# EAGLE board PEGMARev0 (EAGLE 6.6.0), part 1 of 3
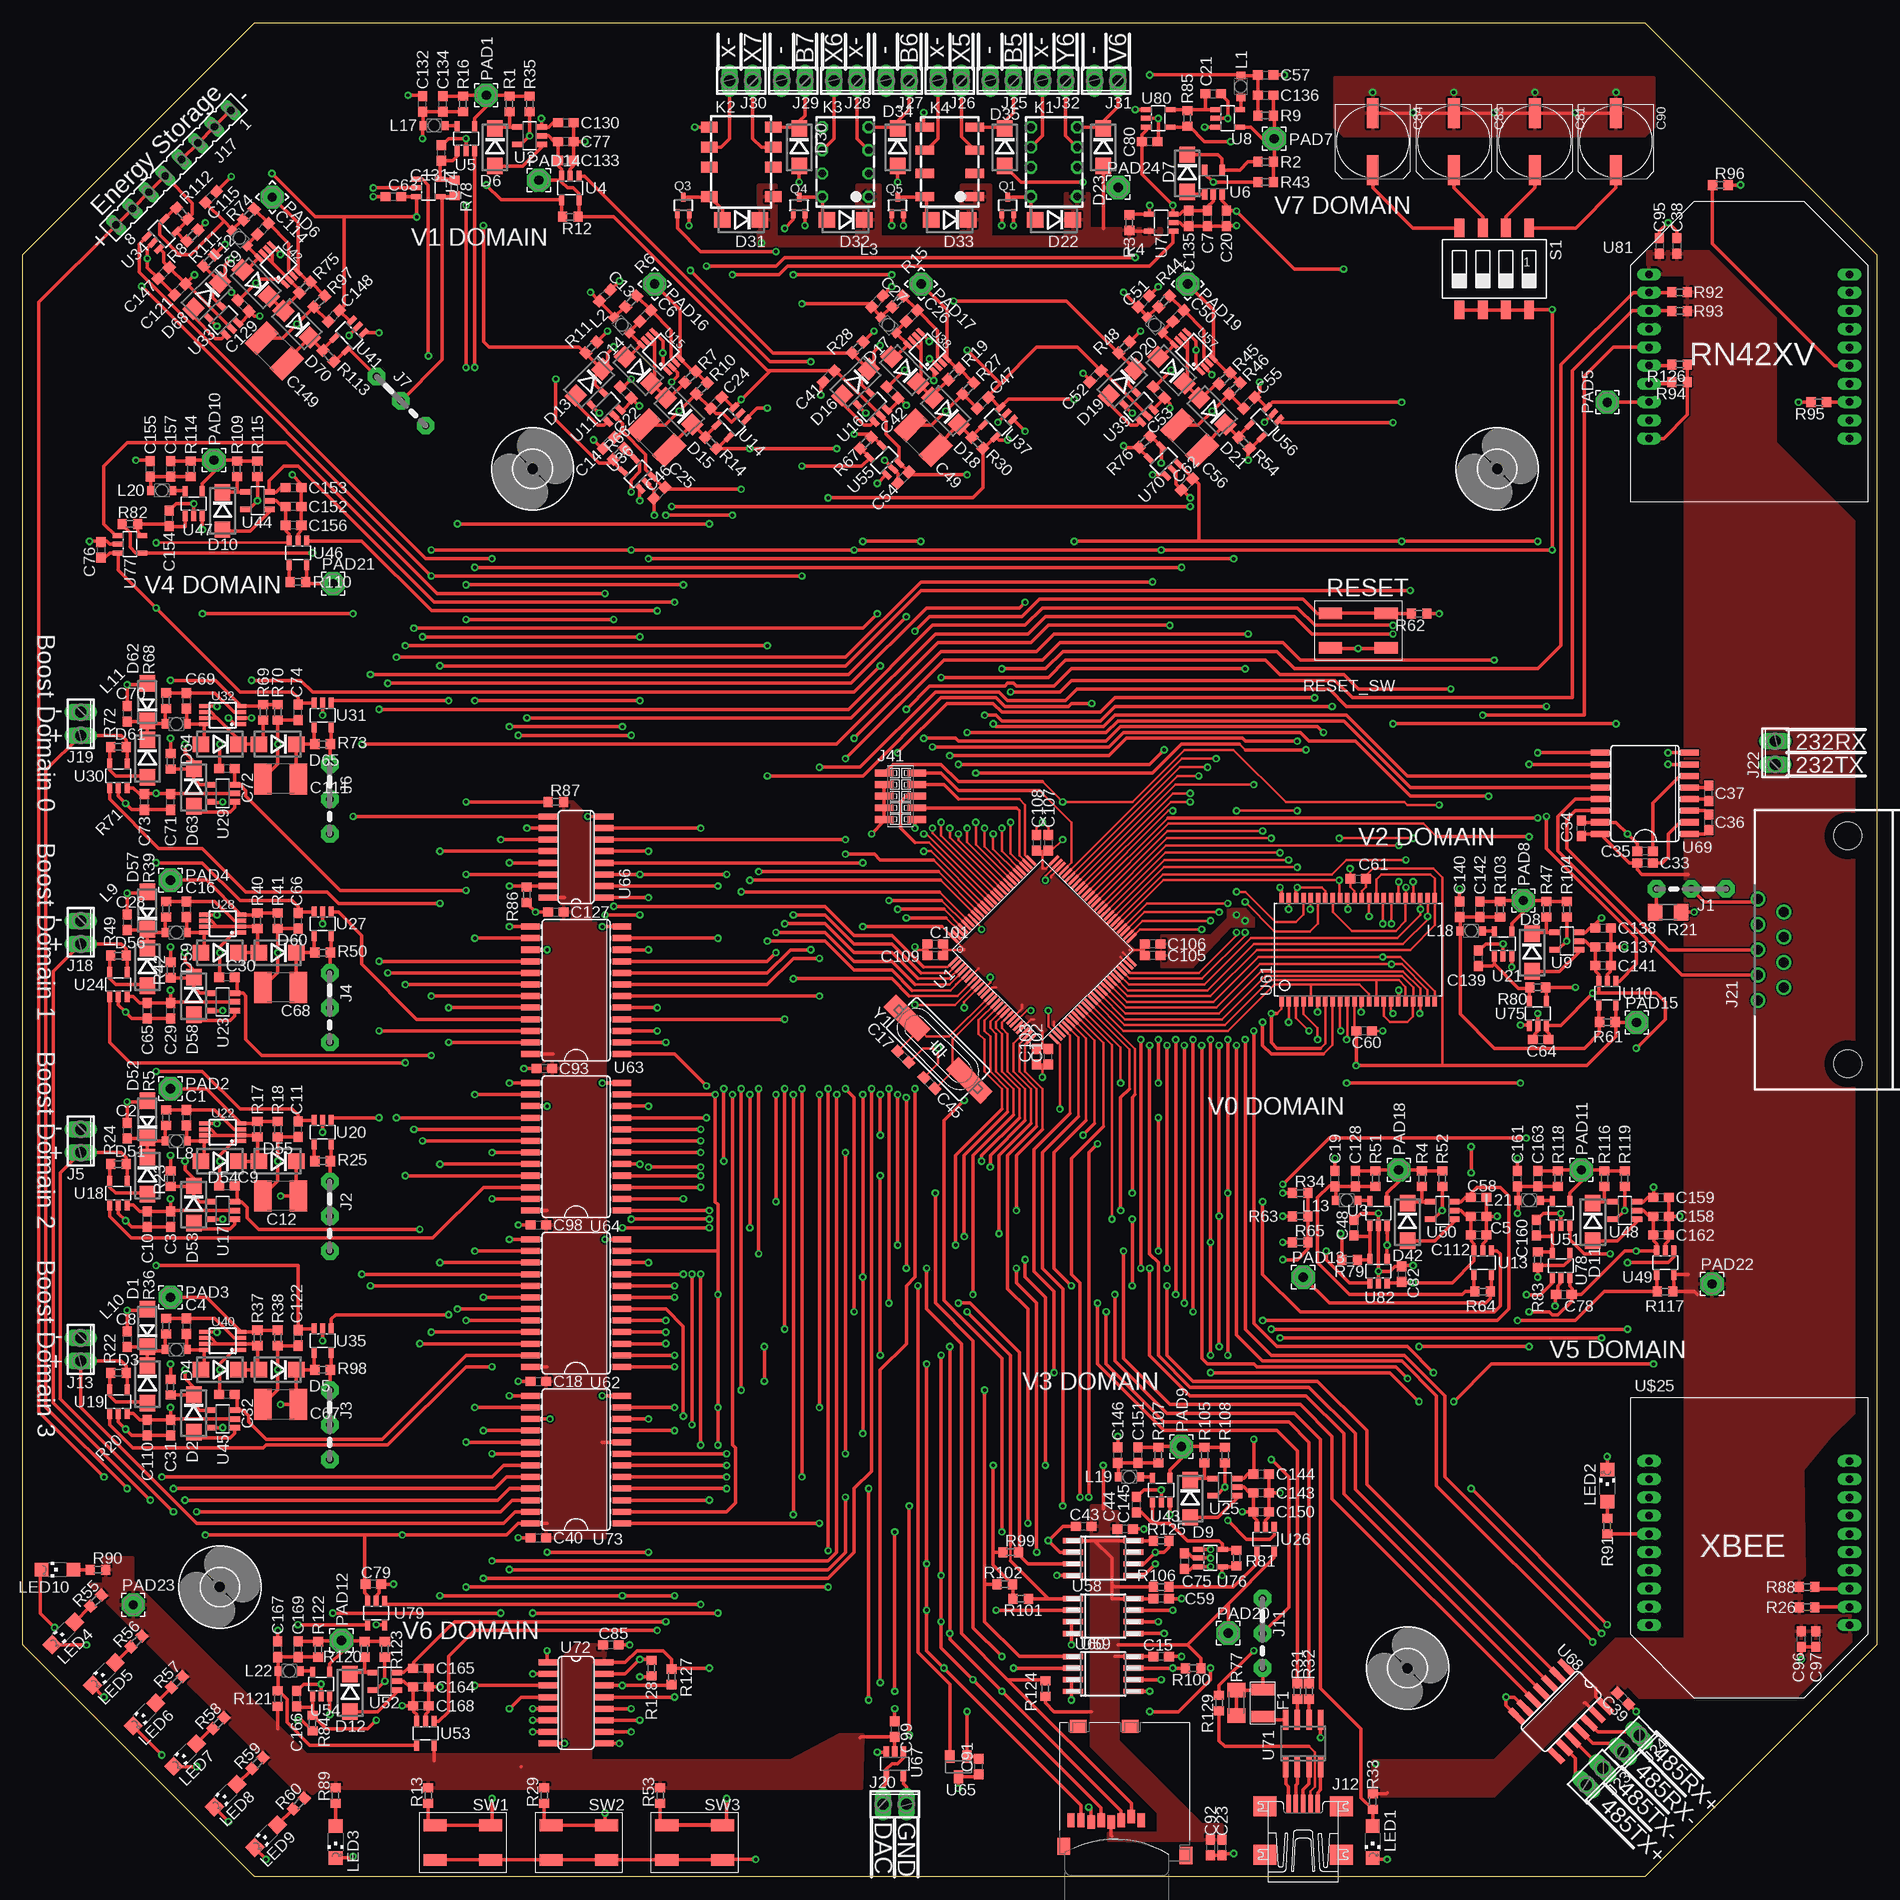
[diagram p5: board, top side]
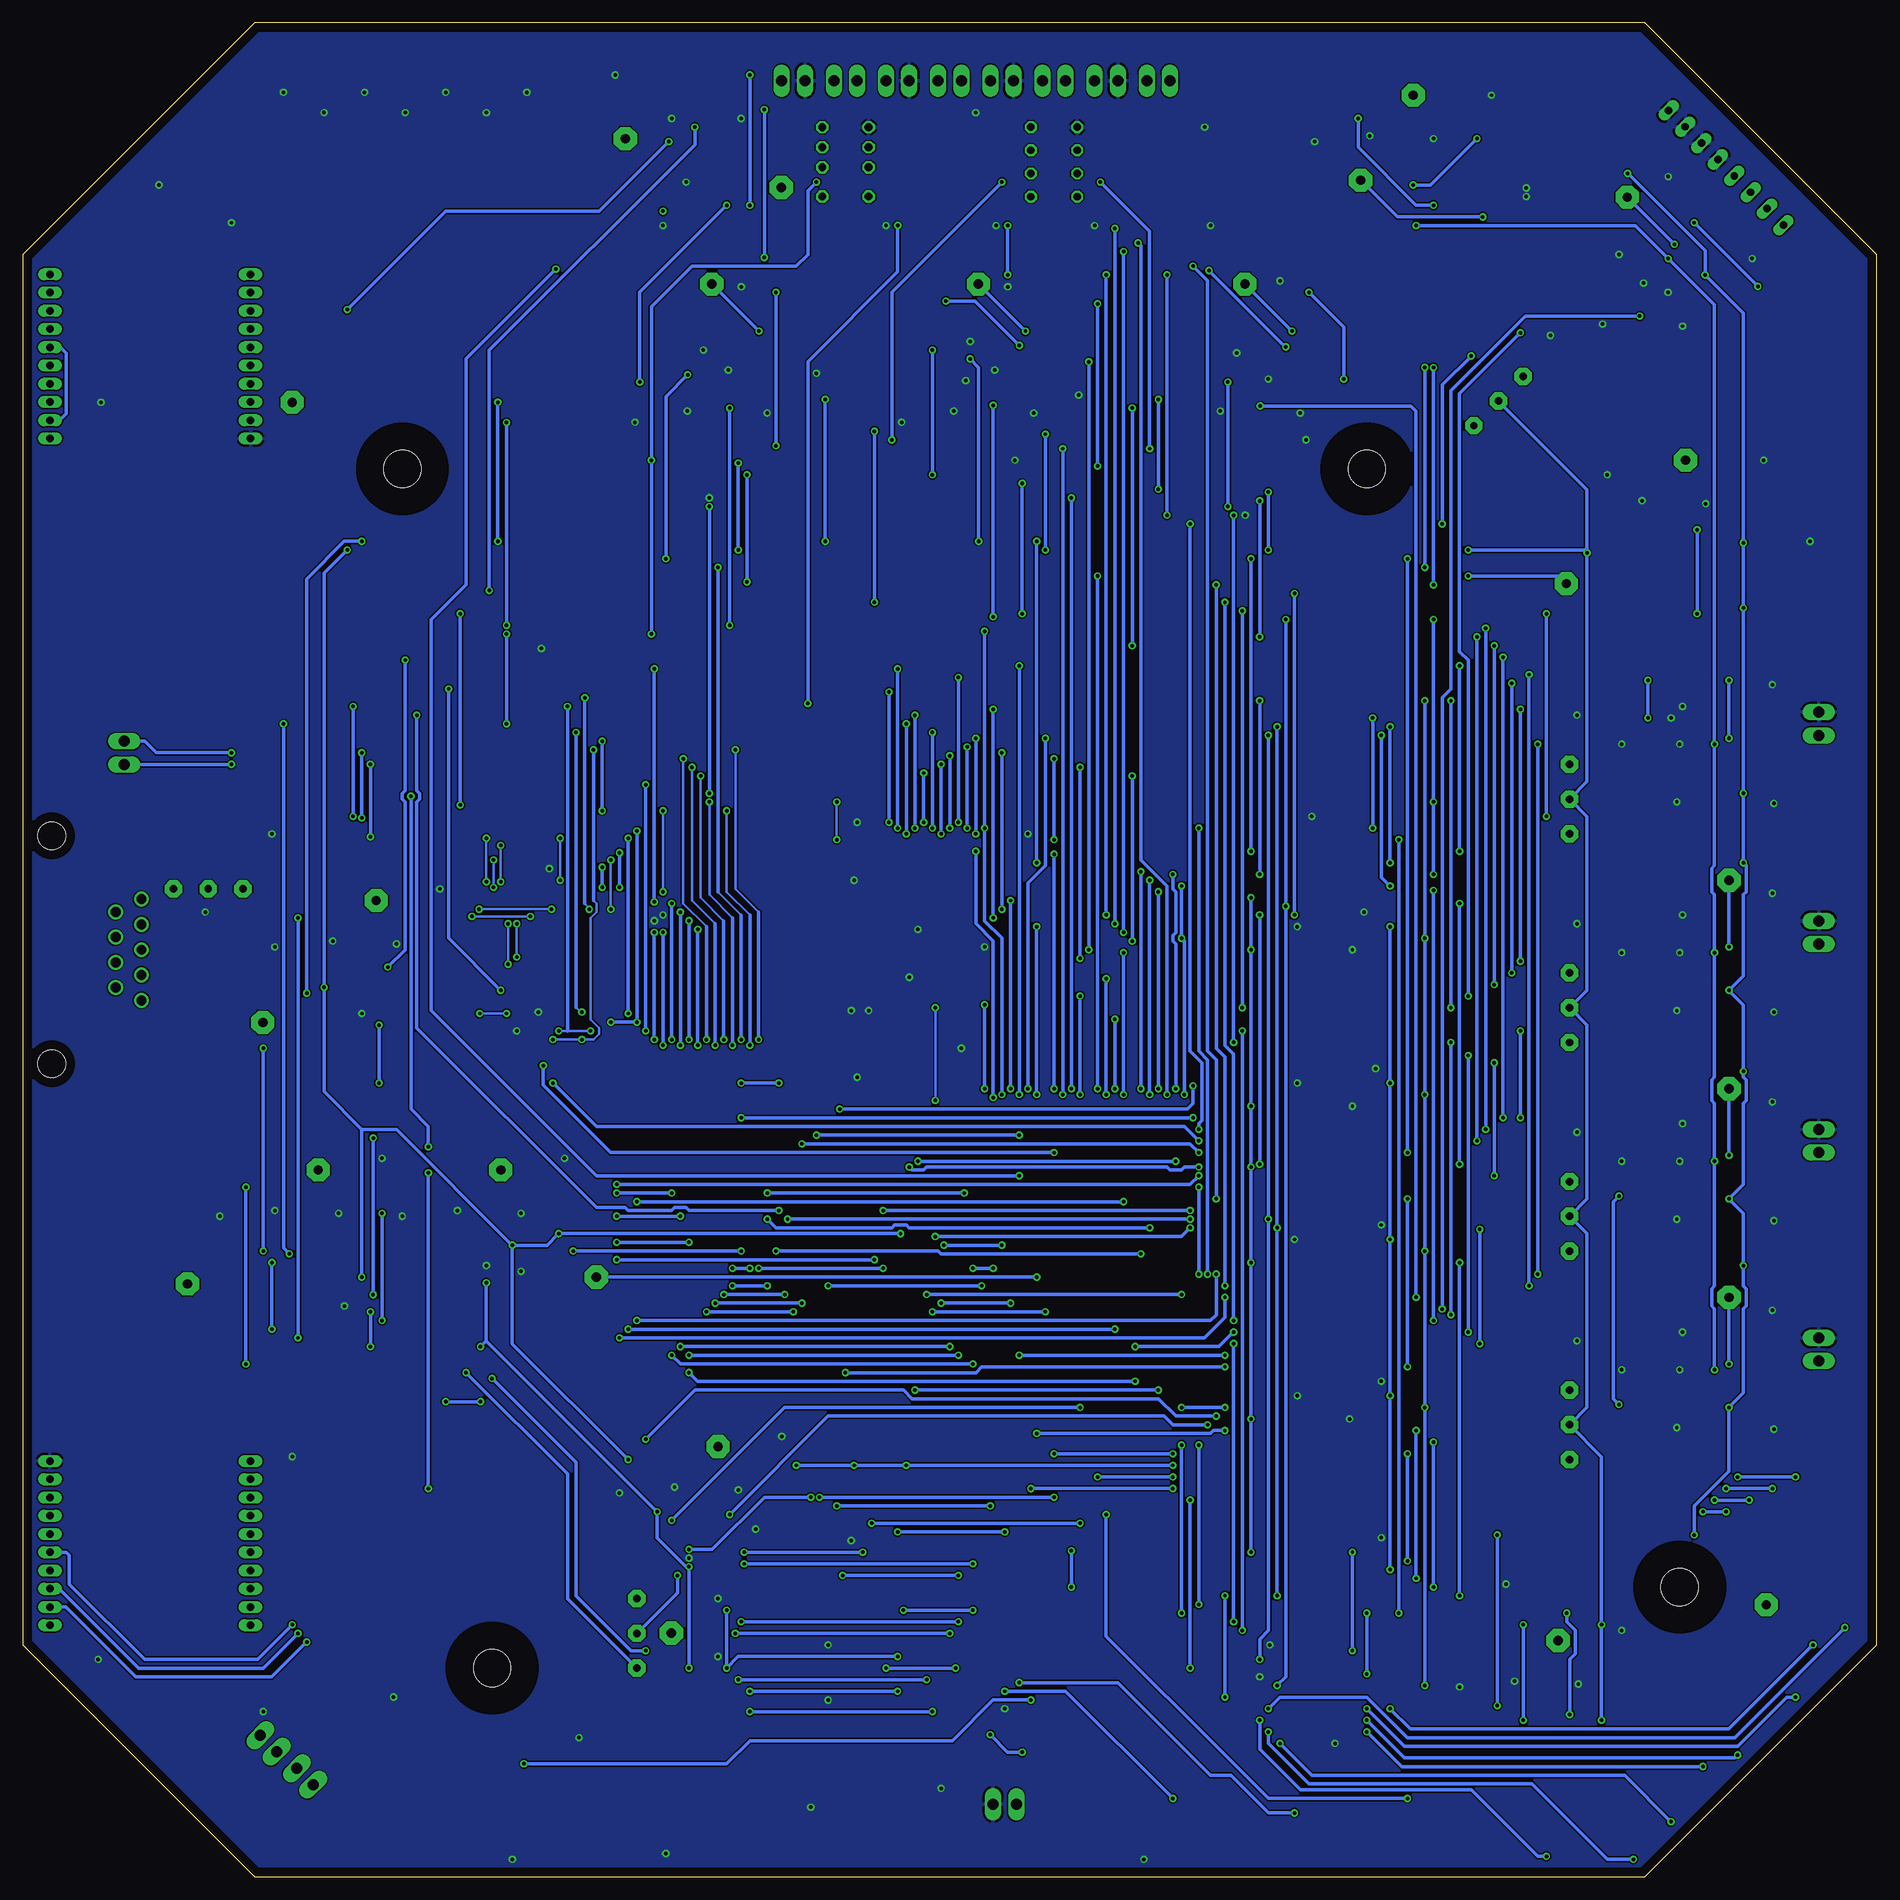
[diagram p6: board, bottom side, seen from below]

Size 203.2 x 203.2 mm. Coordinates in mm from the lower left corner, seen from the top.
Outline: 25.4,0 0,25.4 0,177.8 25.4,203.2 177.8,203.2 203.2,177.8 203.2,25.4 177.8,0 25.4,0
Copper layers (1*16): Top 0.035mm / dielectric 1.5mm / Bottom 0.035mm
Design rules "default": minimum track width 10mil, minimum drill 15mil, track to track 6mil, track to pad 6mil, pad to pad 6mil, via to via 6mil, smd to smd 6mil, copper to edge 40mil, drill to drill 8mil, minimum pad ring 10mil, minimum via ring 8mil, stop-mask expansion 4mil, vias tented up to drill 0mil, thermal gap 10mil

## Footprints (pad centres in the part's own frame; a part is rotated, then mirrored left to right if it is on the bottom)
C0603 = smd 1.1 x 1: 1 -0.85,0; 2 0.85,0
C1812 = smd 1.9 x 3.4: 1 -1.95,0; 2 1.95,0
UD-8X10_NICHICON = smd 3.3 x 1.3: + 3.125,0; - -3.125,0
DO214AC = smd 1.8 x 1.7: A 2.05,0; C -2.05,0
DO214BA = smd 1.8 x 1.7: A 2.05,0; C -2.05,0
FUSE(1210) = smd 1.27 x 2.54: P$1 -1.483,0.03; P$2 1.517,0.03
04C = drill 0.813 pad 1.905 octagon: 1 -1.905,0; 2 1.905,0; 3 5.715,0
2POL254 = drill 1.2 long: 1 -1.27,0; 2 1.27,0
UX60A-MB-5ST = smd 2 x 0.5: 1 2.25,1.6; 2 2.25,0.8; 3 2.25,0; 4 2.25,-0.8; 5 2.25,-1.6 | smd 2.2 x 2.5: M1 -3.3,-4.2; M2 -3.3,4.2; M3 2,4.2; M4 2,-4.2
FE08 = drill 0.813 long: 1 -8.89,0; 2 -6.35,0; 3 -3.81,0; 4 -1.27,0; 5 1.27,0; 6 3.81,0; 7 6.35,0; 8 8.89,0
H2M09RA = drill 1.092: 1 -5.537,7.925; 2 -2.769,7.925; 3 0,7.925; 4 2.769,7.925; 5 5.537,7.925; 6 -4.153,5.08; 7 -1.384,5.08; 8 1.384,5.08; 9 4.153,5.08 | hole 3.048: -12.497,-1.905; 12.497,-1.905
1296-10 = smd 0.76 x 2.05: 1 -2.54,-1.78; 2 -2.54,1.78; 3 -1.27,-1.78; 4 -1.27,1.78; 5 0,-1.78; 6 0,1.78; 7 1.27,-1.78; 8 1.27,1.78; 9 2.54,-1.78; 10 2.54,1.78
G6KU-2P-Y = drill 0.85 octagon: 1 -3.8,-2.54; 2 -0.6,-2.54; 3 1.6,-2.54; 4 3.8,-2.54; 5 3.8,2.54; 6 1.6,2.54; 7 -0.6,2.54; 8 -3.8,2.54
G6KU-2F-Y = smd 1.2 x 1.8: 1 -3.8,-3.5; 2 -0.6,-3.5; 3 1.6,-3.5; 4 3.8,-3.5; 5 3.8,3.5; 6 1.6,3.5; 7 -0.6,3.5; 8 -3.8,3.5
G6K-2P = drill 0.8 octagon: 1 -2.54,-2.54; 2 0,-2.54; 3 2.54,-2.54; 4 5.08,-2.54; 5 5.08,2.54; 6 2.54,2.54; 7 0,2.54; 8 -2.54,2.54
G6K-2G = smd 1 x 2: 1 -3.81,-2.75; 2 -1.27,-2.75; 3 1.27,-2.75; 4 3.81,-2.75; 5 3.81,2.75; 6 1.27,2.75; 7 -1.27,2.75; 8 -3.81,2.75
L1008/2520METRIC = smd 0.8 x 1: 1 -1.2,0; 2 1.2,0
CHIPLED_1206 = smd 1.5 x 1.5: A 0,-1.75; C 0,1.75
2,54/1,0 = drill 1.016 pad 2.54 octagon: 1 0,0
SOT323 = smd 0.5 x 1: 1 0,0.9; 2 -0.65,-0.9; 3 0.65,-0.9
R0603 = smd 1 x 1.1: 1 -0.85,0; 2 0.85,0
R1206 = smd 1.6 x 1.803: 1 -1.422,0; 2 1.422,0
M1206 = smd 1.6 x 2: 1 -1.4,0; 2 1.4,0
SWITCH(B3SN) = smd 2.54 x 1.27: 1 -3.071,-1.97; 2 3.029,-1.97; 3 3.029,1.83; 4 -3.071,1.83
SMS-004 = smd 1.092 x 2.007: 1 -3.81,-4.496; 2 -1.27,-4.496; 3 1.27,-4.496; 4 3.81,-4.496; 5 3.81,4.496; 6 1.27,4.496; 7 -1.27,4.496; 8 -3.81,4.496
PZ100 = smd 1.4 x 0.3: 1 -7.8,6; 2 -7.8,5.5; 3 -7.8,5; 4 -7.8,4.5; 5 -7.8,4; 6 -7.8,3.5; 7 -7.8,3; 8 -7.8,2.5; 9 -7.8,2; 10 -7.8,1.5; 11 -7.8,1; 12 -7.8,0.5; 13 -7.8,0; 14 -7.8,-0.5; 15 -7.8,-1; 16 -7.8,-1.5; 17 -7.8,-2; 18 -7.8,-2.5; 19 -7.8,-3; 20 -7.8,-3.5; 21 -7.8,-4; 22 -7.8,-4.5; 23 -7.8,-5; 24 -7.8,-5.5; 25 -7.8,-6; 51 7.8,-6; 52 7.8,-5.5; 53 7.8,-5; 54 7.8,-4.5; 55 7.8,-4; 56 7.8,-3.5; 57 7.8,-3; 58 7.8,-2.5; 59 7.8,-2; 60 7.8,-1.5; 61 7.8,-1; 62 7.8,-0.5; 63 7.8,0; 64 7.8,0.5; 65 7.8,1; 66 7.8,1.5; 67 7.8,2; 68 7.8,2.5; 69 7.8,3; 70 7.8,3.5; 71 7.8,4; 72 7.8,4.5; 73 7.8,5; 74 7.8,5.5; 75 7.8,6 | smd 0.3 x 1.4: 26 -6,-7.8; 27 -5.5,-7.8; 28 -5,-7.8; 29 -4.5,-7.8; 30 -4,-7.8; 31 -3.5,-7.8; 32 -3,-7.8; 33 -2.5,-7.8; 34 -2,-7.8; 35 -1.5,-7.8; 36 -1,-7.8; 37 -0.5,-7.8; 38 0,-7.8; 39 0.5,-7.8; 40 1,-7.8; 41 1.5,-7.8; 42 2,-7.8; 43 2.5,-7.8; 44 3,-7.8; 45 3.5,-7.8; 46 4,-7.8; 47 4.5,-7.8; 48 5,-7.8; 49 5.5,-7.8; 50 6,-7.8; 76 6,7.8; 77 5.5,7.8; 78 5,7.8; 79 4.5,7.8; 80 4,7.8; 81 3.5,7.8; 82 3,7.8; 83 2.5,7.8; 84 2,7.8; 85 1.5,7.8; 86 1,7.8; 87 0.5,7.8; 88 0,7.8; 89 -0.5,7.8; 90 -1,7.8; 91 -1.5,7.8; 92 -2,7.8; 93 -2.5,7.8; 94 -3,7.8; 95 -3.5,7.8; 96 -4,7.8; 97 -4.5,7.8; 98 -5,7.8; 99 -5.5,7.8; 100 -6,7.8
SOT23-5 = smd 0.6 x 1.2: 1 -0.95,-1.306; 2 0,-1.306; 3 0.95,-1.306; 4 0.95,1.306; 5 -0.95,1.306
SOT23-5' = smd 0.55 x 1.2: 1 -0.95,-1.3; 2 0,-1.3; 3 0.95,-1.3; 4 0.95,1.3; 5 -0.95,1.3
MICROSD = smd 0.8 x 1.5: 1 -1.94,2.7; 2 -0.84,2.3; 3 0.26,2.7; 4 1.36,2.9; 5 2.46,2.7; 6 3.56,2.9; 7 4.66,2.7; 8 5.76,2.7 | smd 1.4 x 1.9: NC -6.85,6.55; NC3 6.55,5.55 | smd 1.8 x 1.4: NC1 -0.75,-7.6; NC2 4.95,-7.6
MSOP8 = smd 0.45 x 1: 1 -0.975,-2.05; 2 -0.325,-2.05; 3 0.325,-2.05; 4 0.975,-2.05; 5 0.975,2.05; 6 0.325,2.05; 7 -0.325,2.05; 8 -0.975,2.05
SO-08M = smd 0.6 x 2.2: 1 -1.905,-3.33; 2 -0.635,-3.33; 3 0.635,-3.33; 4 1.905,-3.33; 5 1.905,3.33; 6 0.635,3.33; 7 -0.635,3.33; 8 -1.905,3.33
TSOPII-Z44 = smd 0.5 x 1.2: 1 -8.4,-5.627; 2 -7.6,-5.627; 3 -6.8,-5.627; 4 -6,-5.627; 5 -5.2,-5.627; 6 -4.4,-5.627; 7 -3.6,-5.627; 8 -2.8,-5.627; 9 -2,-5.627; 10 -1.2,-5.627; 11 -0.4,-5.627; 12 0.4,-5.627; 13 1.2,-5.627; 14 2,-5.627; 15 2.8,-5.627; 16 3.6,-5.627; 17 4.4,-5.627; 18 5.2,-5.627; 19 6,-5.627; 20 6.8,-5.627; 21 7.6,-5.627; 22 8.4,-5.627; 23 8.4,5.627; 24 7.6,5.627; 25 6.8,5.627; 26 6,5.627; 27 5.2,5.627; 28 4.4,5.627; 29 3.6,5.627; 30 2.8,5.627; 31 2,5.627; 32 1.2,5.627; 33 0.4,5.627; 34 -0.4,5.627; 35 -1.2,5.627; 36 -2,5.627; 37 -2.8,5.627; 38 -3.6,5.627; 39 -4.4,5.627; 40 -5.2,5.627; 41 -6,5.627; 42 -6.8,5.627; 43 -7.6,5.627; 44 -8.4,5.627
SO24W = smd 0.66 x 2.032: 1 -6.985,-5.029; 2 -5.715,-5.029; 3 -4.445,-5.029; 4 -3.175,-5.029; 5 -1.905,-5.029; 6 -0.635,-5.029; 7 0.635,-5.029; 8 1.905,-5.029; 9 3.175,-5.029; 10 4.445,-5.029; 11 5.715,-5.029; 12 6.985,-5.029; 13 6.985,5.029; 14 5.715,5.029; 15 4.445,5.029; 16 3.175,5.029; 17 1.905,5.029; 18 0.635,5.029; 19 -0.635,5.029; 20 -1.905,5.029; 21 -3.175,5.029; 22 -4.445,5.029; 23 -5.715,5.029; 24 -6.985,5.029
SOT23 = smd 1 x 1.4: 1 -0.95,-1.1; 2 0.95,-1.1; 3 0,1.1
SO16 = smd 0.66 x 2.032: 1 -4.445,-3.073; 2 -3.175,-3.073; 3 -1.905,-3.073; 4 -0.635,-3.073; 5 0.635,-3.073; 6 1.905,-3.073; 7 3.175,-3.073; 8 4.445,-3.073; 9 4.445,3.073; 10 3.175,3.073; 11 1.905,3.073; 12 0.635,3.073; 13 -0.635,3.073; 14 -1.905,3.073; 15 -3.175,3.073; 16 -4.445,3.073
SO14 = smd 0.66 x 2.032: 1 -3.81,-3.073; 2 -2.54,-3.073; 3 -1.27,-3.073; 4 0,-3.073; 5 1.27,-3.073; 6 2.54,-3.073; 7 3.81,-3.073; 8 3.81,3.073; 9 2.54,3.073; 10 1.27,3.073; 11 0,3.073; 12 -1.27,3.073; 13 -2.54,3.073; 14 -3.81,3.073
SO16L = smd 0.66 x 2.032: 1 -4.445,-4.902; 2 -3.175,-4.902; 3 -1.905,-4.902; 4 -0.635,-4.902; 5 0.635,-4.902; 6 1.905,-4.902; 7 3.175,-4.902; 8 4.445,-4.902; 9 4.445,4.902; 10 3.175,4.902; 11 1.905,4.902; 12 0.635,4.902; 13 -0.635,4.902; 14 -1.905,4.902; 15 -3.175,4.902; 16 -4.445,4.902
SO08 = smd 0.6 x 2.2: 1 -1.905,-2.6; 2 -0.635,-2.6; 3 0.635,-2.6; 4 1.905,-2.6; 5 1.905,2.6; 6 0.635,2.6; 7 -0.635,2.6; 8 -1.905,2.6
RN42XV = drill 0.813 long: 1 -11,9.27; 2 -11,7.27; 3 -11,5.27; 4 -11,3.27; 5 -11,1.27; 6 -11,-0.73; 7 -11,-2.73; 8 -11,-4.73; 9 -11,-6.73; 10 -11,-8.73; 11 11,-8.73; 12 11,-6.73; 13 11,-4.73; 14 11,-2.73; 15 11,-0.73; 16 11,1.27; 17 11,3.27; 18 11,5.27; 19 11,7.27; 20 11,9.27
4,1 = hole 4.1: 0,0
XBEE = drill 0.813 long: 1 -11,8; 2 -11,6; 3 -11,4; 4 -11,2; 5 -11,0; 6 -11,-2; 7 -11,-4; 8 -11,-6; 9 -11,-8; 10 -11,-10; 11 11,-10; 12 11,-8; 13 11,-6; 14 11,-4; 15 11,-2; 16 11,0; 17 11,2; 18 11,4; 19 11,6; 20 11,8
HC49UP = smd 5.334 x 1.93: 1 -4.826,0; 2 4.826,0

## Placement (x,y rotation side)
C1  4.7pF  [C0603]  17.94,83.19 270 top
C2  22uF  [C0603]  11.43,81.76 270 top
C3  .1uF  [C0603]  16.19,72.07 90 top
C4  4.7pF  [C0603]  17.94,60.33 270 top
C5  .1uF  [C0603]  159.54,72.39 180 top
C6  4.7pF  [C0603]  68.24,171.09 225 top
C7  .1uF  [C0603]  129.86,181.77 90 top
C8  22uF  [C0603]  11.43,58.9 270 top
C9  10uF  [C0603]  22.38,75.72 180 top
C10  .1uF  [C0603]  13.65,72.07 90 top
C11  .1uF  [C0603]  30.16,81.92 90 top
C12  100uF Tantalum  [C1812]  28.26,74.61 180 top
C13  22uF  [C0603]  63.79,173.3 225 top
C14  .1uF  [C0603]  64.23,157.16 45 top
C15  .1uF  [C0603]  124.78,24.13 180 top
C16  4.7pF  [C0603]  17.94,106.05 270 top
C17  16pF  [C0603]  96.52,89.85 135 top
C18  .1uF  [C0603]  56.52,54.29 0 top
C19  10uF  [C0603]  143.83,76.52 90 top
C20  10uF  [C0603]  131.92,181.77 270 top
C21  4.7uF  [C0603]  130.49,195.42 0 top
C22  10uF  [C0603]  66.11,162.67 135 top
C23  10uF  [C0603]  131.44,3.17 90 top
C24  .1uF  [C0603]  75.99,161.55 45 top
C25  100uF Tantalum  [C1812]  69.48,157.73 135 top
C26  4.7pF  [C0603]  97.45,171.09 225 top
C27  22uF  [C0603]  93.63,172.66 225 top
C28  22uF  [C0603]  11.43,104.62 270 top
C29  .1uF  [C0603]  16.19,94.93 90 top
C30  10uF  [C0603]  22.38,98.58 180 top
C31  .1uF  [C0603]  16.19,49.21 90 top
C32  10uF  [C0603]  22.38,52.86 180 top
C33  .1uF  [C0603]  177.8,111.12 180 top
C34  .1uF  [C0603]  170.81,114.94 90 top
C35  .1uF  [C0603]  177.8,112.39 180 top
C36  .1uF  [C0603]  184.78,115.57 90 top
C37  .1uF  [C0603]  184.78,118.75 90 top
C38  .1uF  [C0603]  181.29,178.75 270 top
C39  .1uF  [C0603]  175.42,19.53 315 top
C40  .1uF  [C0603]  56.52,37.15 0 top
C41  .1uF  [C0603]  88.36,164.47 45 top
C42  10uF  [C0603]  95.32,162.67 135 top
C43  .22uF  [C0603]  116.28,38.42 0 top
C44  .1uF  [C0603]  120.81,38.1 180 top
C45  16pF  [C0603]  99.38,87 135 top
C46  .1uF  [C0603]  69.76,151.67 45 top
C47  .1uF  [C0603]  105.2,161.55 45 top
C48  4.7uF  [C0603]  145.89,71.12 90 top
C49  100uF Tantalum  [C1812]  98.69,157.73 135 top
C50  4.7pF  [C0603]  126.66,171.09 225 top
C51  22uF  [C0603]  122.84,172.66 225 top
C52  .1uF  [C0603]  117.57,164.47 45 top
C53  10uF  [C0603]  124.53,162.67 135 top
C54  .1uF  [C0603]  96.52,153.35 45 top
C55  .1uF  [C0603]  134.41,161.55 45 top
C56  100uF Tantalum  [C1812]  127.9,157.73 135 top
C57  10uF  [C0603]  136.21,197.49 0 top
C58  10uF  [C0603]  159.54,74.45 0 top
C59  .1uF  [C0603]  124.78,30.48 180 top
C60  .1uF  [C0603]  147,92.71 180 top
C61  .1uF  [C0603]  146.37,109.38 0 top
C62  .1uF  [C0603]  127.6,152.62 45 top
C63  .1uF  [C0603]  40.64,184.15 0 top
C64  .1uF  [C0603]  166.37,91.76 0 top
C65  .1uF  [C0603]  13.65,94.93 90 top
C66  .1uF  [C0603]  30.16,104.78 90 top
C67  100uF Tantalum  [C1812]  28.26,51.75 180 top
C68  100uF Tantalum  [C1812]  28.26,97.47 180 top
C69  4.7pF  [C0603]  17.94,128.91 270 top
C70  22uF  [C0603]  11.43,127.48 270 top
C71  .1uF  [C0603]  16.19,117.79 90 top
C72  10uF  [C0603]  22.38,121.44 180 top
C73  .1uF  [C0603]  13.34,117.79 90 top
C74  .1uF  [C0603]  30.16,127.64 90 top
C75  .1uF  [C0603]  127.32,34.61 270 top
C76  .1uF  [C0603]  8.57,145.41 270 top
C77  .1uF  [C0603]  59.53,190.18 180 top
C78  .1uF  [C0603]  168.91,63.82 0 top
C79  .1uF  [C0603]  38.42,32.07 180 top
C80  .1uF  [C0603]  123.51,190.18 180 top
C81  220uF  [UD-8X10_NICHICON]  165.74,190.18 270 top
C82  .1uF  [C0603]  151.13,66.04 270 top
C83  220uF  [UD-8X10_NICHICON]  156.84,190.18 270 top
C84  220uF  [UD-8X10_NICHICON]  147.96,190.18 270 top
C85  .1uF  [C0603]  64.45,25.4 180 top
C90  220uF  [UD-8X10_NICHICON]  174.62,190.18 270 top
C91  .1uF  [C0603]  104.78,12.06 90 top
C92  .1uF  [C0603]  130.18,3.17 270 top
C93  .1uF  [C0603]  57.15,88.58 0 top
C95  10uF  [C0603]  179.39,178.75 270 top
C96  .1uF  [C0603]  194.94,26.04 90 top
C97  10uF  [C0603]  196.53,26.04 90 top
C98  .1uF  [C0603]  56.52,71.44 0 top
C99  .1uF  [C0603]  95.57,16.19 270 top
C101  .1uF  [C0603]  100.01,102.23 0 top
C102  .1uF  [C0603]  112.39,89.85 90 top
C103  .1uF  [C0603]  111.12,89.85 90 top
C105  .1uF  [C0603]  123.83,100.97 180 top
C106  .1uF  [C0603]  123.83,102.23 180 top
C107  .1uF  [C0603]  112.39,113.35 270 top
C108  .1uF  [C0603]  111.12,113.35 270 top
C109  .1uF  [C0603]  100.01,100.97 0 top
C110  .1uF  [C0603]  13.65,49.21 90 top
C111  100uF Tantalum  [C1812]  28.26,120.33 180 top
C112  .1uF  [C0603]  159.54,70.33 180 top
C114  4.7pF  [C0603]  26.33,180.61 225 top
C115  22uF  [C0603]  20.61,184.09 225 top
C121  .1uF  [C0603]  17.24,173.99 45 top
C122  .1uF  [C0603]  30.16,59.05 90 top
C127  .1uF  [C0603]  58.42,105.73 0 top
C128  33pF  [C0603]  146.05,76.52 90 top
C129  10uF  [C0603]  24.2,172.19 135 top
C130  10uF  [C0603]  59.53,192.25 0 top
C131  4.7uF  [C0603]  45.88,188.91 90 top
C132  10uF  [C0603]  43.81,194.31 90 top
C133  .1uF  [C0603]  59.53,188.12 180 top
C134  33pF  [C0603]  46.04,194.31 90 top
C135  .1uF  [C0603]  127.79,181.77 90 top
C136  33pF  [C0603]  136.21,195.26 0 top
C137  .1uF  [C0603]  173.2,101.92 180 top
C138  10uF  [C0603]  173.2,103.98 0 top
C139  4.7uF  [C0603]  159.54,100.65 90 top
C140  10uF  [C0603]  157.48,106.05 90 top
C141  .1uF  [C0603]  173.2,99.85 180 top
C142  33pF  [C0603]  159.7,106.05 90 top
C143  .1uF  [C0603]  135.73,42.07 180 top
C144  10uF  [C0603]  135.73,44.13 0 top
C145  4.7uF  [C0603]  122.08,40.8 90 top
C146  10uF  [C0603]  120.02,46.2 90 top
C147  .1uF  [C0603]  15.44,175.79 45 top
C148  .1uF  [C0603]  34.08,171.07 45 top
C149  100uF Tantalum  [C1812]  27.57,167.25 135 top
C150  .1uF  [C0603]  135.73,40.01 180 top
C151  33pF  [C0603]  122.24,46.2 90 top
C152  .1uF  [C0603]  29.69,150.18 180 top
C153  10uF  [C0603]  29.69,152.24 0 top
C154  4.7uF  [C0603]  16.03,148.91 90 top
C155  10uF  [C0603]  13.97,154.31 90 top
C156  .1uF  [C0603]  29.69,148.11 180 top
C157  33pF  [C0603]  16.19,154.31 90 top
C158  .1uF  [C0603]  179.55,72.39 180 top
C159  10uF  [C0603]  179.55,74.45 0 top
C160  4.7uF  [C0603]  165.89,71.12 90 top
C161  10uF  [C0603]  163.83,76.52 90 top
C162  .1uF  [C0603]  179.55,70.33 180 top
C163  33pF  [C0603]  166.05,76.52 90 top
C164  .1uF  [C0603]  43.66,20.8 180 top
C165  10uF  [C0603]  43.66,22.86 0 top
C166  4.7uF  [C0603]  30,19.53 90 top
C167  10uF  [C0603]  27.94,24.92 90 top
C168  .1uF  [C0603]  43.66,18.73 180 top
C169  33pF  [C0603]  30.16,24.92 90 top
D1  TPSMA11HE3  [DO214AC]  13.65,60.17 90 top
D2  LSM115JE3  [DO214BA]  18.73,50.8 270 top
D3  LSM115JE3  [DO214BA]  13.65,53.98 270 top
D4  LSM115JE3  [DO214BA]  21.59,55.56 180 top
D5  LSM115JE3  [DO214BA]  27.94,55.56 180 top
D6  LSM115JE3  [DO214BA]  51.75,189.55 270 top
D7  LSM115JE3  [DO214BA]  127.64,186.69 270 top
D8  LSM115JE3  [DO214BA]  165.42,101.28 270 top
D9  LSM115JE3  [DO214BA]  127.95,41.43 270 top
D10  LSM115JE3  [DO214BA]  21.91,149.7 270 top
D11  LSM115JE3  [DO214BA]  172.09,71.75 270 top
D12  LSM115JE3  [DO214BA]  35.88,20.16 270 top
D13  LSM115JE3  [DO214BA]  62.07,163.79 225 top
D14  LSM115JE3  [DO214BA]  67.46,165.14 135 top
D15  LSM115JE3  [DO214BA]  71.95,160.65 135 top
D16  LSM115JE3  [DO214BA]  91.28,163.79 225 top
D17  LSM115JE3  [DO214BA]  96.67,165.14 135 top
D18  LSM115JE3  [DO214BA]  101.16,160.65 135 top
D19  LSM115JE3  [DO214BA]  120.49,163.79 225 top
D20  LSM115JE3  [DO214BA]  125.88,165.14 135 top
D21  LSM115JE3  [DO214BA]  130.37,160.65 135 top
D22  LSM115JE3  [DO214BA]  113.03,181.61 180 top
D23  LSM115JE3  [DO214BA]  118.43,189.55 270 top
D30  LSM115JE3  [DO214BA]  85.09,189.55 270 top
D31  LSM115JE3  [DO214BA]  78.74,181.61 180 top
D32  LSM115JE3  [DO214BA]  90.17,181.61 180 top
D33  LSM115JE3  [DO214BA]  101.6,181.61 180 top
D34  LSM115JE3  [DO214BA]  95.89,189.55 270 top
D35  LSM115JE3  [DO214BA]  107.63,189.55 270 top
D42  LSM115JE3  [DO214BA]  151.76,71.75 270 top
D51  LSM115JE3  [DO214BA]  13.65,76.83 270 top
D52  TPSMA11HE3  [DO214AC]  13.65,83.03 90 top
D53  LSM115JE3  [DO214BA]  18.73,73.66 270 top
D54  LSM115JE3  [DO214BA]  21.59,78.42 180 top
D55  LSM115JE3  [DO214BA]  27.94,78.42 180 top
D56  LSM115JE3  [DO214BA]  13.65,99.69 270 top
D57  TPSMA11HE3  [DO214AC]  13.65,105.89 90 top
D58  LSM115JE3  [DO214BA]  18.73,96.52 270 top
D59  LSM115JE3  [DO214BA]  21.59,101.28 180 top
D60  LSM115JE3  [DO214BA]  27.94,101.28 180 top
D61  LSM115JE3  [DO214BA]  13.65,122.56 270 top
D62  TPSMA11HE3  [DO214AC]  13.65,128.75 90 top
D63  LSM115JE3  [DO214BA]  18.73,119.38 270 top
D64  LSM115JE3  [DO214BA]  21.59,124.14 180 top
D65  LSM115JE3  [DO214BA]  27.94,124.14 180 top
D68  LSM115JE3  [DO214BA]  20.16,173.32 225 top
D69  LSM115JE3  [DO214BA]  25.55,174.66 135 top
D70  LSM115JE3  [DO214BA]  30.04,170.17 135 top
F1  MS-USMF010  [FUSE(1210)]  135.89,19.05 270 top
J1  [04C]  184.78,108.27 180 top
J2  [04C]  33.66,74.3 270 top
J3  [04C]  33.66,51.44 270 top
J4  [04C]  33.66,97.16 270 top
J5  [2POL254]  6.35,80.64 270 top
J6  [04C]  33.66,120.02 270 top
J7  Molex 22-28-4030  [04C]  40.11,163.09 315 top
J11  [04C]  135.89,28.57 270 top
J12  MINI-USB-UX60A-MB-5ST  [UX60A-MB-5ST]  140.34,5.71 90 top
J13  [2POL254]  6.35,57.78 270 top
J17  [FE08]  16.51,187.32 225 top
J18  [2POL254]  6.35,103.5 270 top
J19  [2POL254]  6.35,126.36 270 top
J20  [2POL254]  95.57,7.94 0 top
J21  D-SUB9-H2M09RA  [H2M09RA]  198.12,101.6 90 top
J22  [2POL254]  192.09,123.19 90 top
J23  [2POL254]  172.27,10.98 225 top
J24  [2POL254]  176.27,14.61 225 top
J25  [2POL254]  107.31,196.85 180 top
J26  [2POL254]  101.6,196.85 180 top
J27  [2POL254]  95.89,196.85 180 top
J28  [2POL254]  90.17,196.85 180 top
J29  [2POL254]  84.45,196.85 180 top
J30  [2POL254]  78.74,196.85 180 top
J31  [2POL254]  118.75,196.85 180 top
J32  [2POL254]  113.03,196.85 180 top
J41  FTSH-105-02-F-D  [1296-10]  96.2,118.43 270 top
K1  G6KU-2P-Y  [G6KU-2P-Y]  113.03,187.96 90 top
K2  G6KU-2F-Y  [G6KU-2F-Y]  78.74,187.96 90 top
K3  G6K-2P  [G6K-2P]  90.17,186.69 90 top
K4  G6K-2G  [G6K-2G]  101.6,187.96 90 top
L1  4.7uH  [L1008/2520METRIC]  133.51,196.22 90 top
L2  4.7uH  [L1008/2520METRIC]  65.66,170.08 315 top
L3  4.7uH  [L1008/2520METRIC]  94.87,170.08 315 top
L4  4.7uH  [L1008/2520METRIC]  124.08,170.08 315 top
L8  4.7uH  [L1008/2520METRIC]  16.83,80.64 0 top
L9  4.7uH  [L1008/2520METRIC]  16.83,103.5 0 top
L10  4.7uH  [L1008/2520METRIC]  16.83,57.78 0 top
L11  4.7uH  [L1008/2520METRIC]  16.83,126.36 0 top
L12  4.7uH  [L1008/2520METRIC]  23.75,179.6 315 top
L13  4.7uH  [L1008/2520METRIC]  145.1,74.14 180 top
L17  4.7uH  [L1008/2520METRIC]  45.09,191.93 180 top
L18  4.7uH  [L1008/2520METRIC]  158.75,103.66 180 top
L19  4.7uH  [L1008/2520METRIC]  121.28,43.81 180 top
L20  4.7uH  [L1008/2520METRIC]  15.24,151.92 180 top
L21  4.7uH  [L1008/2520METRIC]  165.1,74.14 180 top
L22  4.7uH  [L1008/2520METRIC]  29.21,22.54 180 top
LED1  [CHIPLED_1206]  147.96,3.81 180 top
LED2  [CHIPLED_1206]  173.67,42.86 0 top
LED3  [CHIPLED_1206]  34.29,3.81 180 top
LED4  [CHIPLED_1206]  4.45,26.67 135 top
LED5  [CHIPLED_1206]  8.89,22.23 135 top
LED6  [CHIPLED_1206]  13.34,17.78 135 top
LED7  [CHIPLED_1206]  17.78,13.34 135 top
LED8  [CHIPLED_1206]  22.23,8.89 135 top
LED9  [CHIPLED_1206]  26.67,4.45 135 top
LED10  [CHIPLED_1206]  3.81,33.66 90 top
PAD1  [2,54/1,0]  50.8,195.26 0 top
PAD2  [2,54/1,0]  16.19,86.36 180 top
PAD3  [2,54/1,0]  16.19,63.5 180 top
PAD4  [2,54/1,0]  16.19,109.22 180 top
PAD5  [2,54/1,0]  173.67,161.61 90 top
PAD6  [2,54/1,0]  27.34,184.09 135 top
PAD7  [2,54/1,0]  137.16,190.5 270 top
PAD8  [2,54/1,0]  164.47,107 0 top
PAD9  [2,54/1,0]  127,47.15 0 top
PAD10  [2,54/1,0]  20.95,155.26 0 top
PAD11  [2,54/1,0]  170.81,77.47 0 top
PAD12  [2,54/1,0]  34.92,25.88 0 top
PAD13  [2,54/1,0]  140.34,65.72 0 top
PAD14  [2,54/1,0]  56.56,185.94 0 top
PAD15  [2,54/1,0]  176.9,93.62 0 top
PAD16  [2,54/1,0]  69.25,174.57 135 top
PAD17  [2,54/1,0]  98.46,174.57 135 top
PAD18  [2,54/1,0]  150.81,77.47 0 top
PAD19  [2,54/1,0]  127.67,174.57 135 top
PAD20  [2,54/1,0]  132.13,26.71 0 top
PAD21  [2,54/1,0]  34.02,141.73 0 top
PAD22  [2,54/1,0]  185.15,64.97 0 top
PAD23  [2,54/1,0]  12.11,29.81 0 top
PAD24  [2,54/1,0]  120.06,185.15 0 top
Q1  2N2222  [SOT323]  107.95,183.2 0 top
Q3  2N2222  [SOT323]  72.39,183.2 0 top
Q4  2N2222  [SOT323]  85.09,183.2 0 top
Q5  2N2222  [SOT323]  95.89,183.2 0 top
R1  144k  [R0603]  53.34,194.31 90 top
R2  144k  [R0603]  136.21,187.96 0 top
R3  .11  [R0603]  121.28,181.29 90 top
R4  144k  [R0603]  153.35,76.52 90 top
R5  150k  [R0603]  15.72,83.19 270 top
R6  150k  [R0603]  66.67,172.66 225 top
R7  180k  [R0603]  73.16,164.37 225 top
R8  30  [R0603]  18.6,179.89 225 top
R9  360k  [R0603]  136.21,193.04 180 top
R10  75k  [R0603]  74.42,163.12 45 top
R11  22k  [R0603]  62.29,167.61 45 top
R12  .263  [R0603]  60.01,181.93 180 top
R13  1K  [R0603]  44.45,8.89 90 top
R14  0.10  [R0603]  75.43,157.17 135 top
R15  150k  [R0603]  95.88,172.66 225 top
R16  360k  [R0603]  48.26,194.31 270 top
R17  125k  [R0603]  25.72,81.92 270 top
R18  75k  [R0603]  27.94,81.92 90 top
R19  180k  [R0603]  102.06,164.69 225 top
R20  60k  [R0603]  16.19,53.66 90 top
R21  120  [R1206]  180.34,105.73 180 top
R22  .033  [R0603]  10.48,55.24 180 top
R23  60k  [R0603]  16.19,76.52 90 top
R24  .044  [R0603]  10.48,78.11 180 top
R25  .044  [R0603]  32.86,78.42 180 top
R26  100k  [R0603]  195.58,29.53 180 top
R27  75k  [R0603]  103.63,163.12 45 top
R28  22k  [R0603]  91.5,167.61 45 top
R29  1K  [R0603]  57.15,8.89 90 top
R30  0.10  [R0603]  104.64,157.17 135 top
R31  22  [R0603]  139.7,20.32 270 top
R32  22  [R0603]  140.97,20.32 270 top
R33  1k  [R0603]  147.96,8.26 270 top
R34  47k  [R0603]  140.02,74.93 0 top
R35  75k  [R0603]  55.56,194.31 90 top
R36  150k  [R0603]  15.72,60.33 270 top
R37  125k  [R0603]  25.72,59.05 270 top
R38  75k  [R0603]  27.94,59.05 90 top
R39  150k  [R0603]  15.72,106.05 270 top
R40  125k  [R0603]  25.72,104.78 270 top
R41  75k  [R0603]  27.94,104.78 90 top
R42  60k  [R0603]  16.19,99.38 90 top
R43  75k  [R0603]  136.21,185.74 0 top
R44  150k  [R0603]  125.09,172.66 225 top
R45  180k  [R0603]  131.74,164.21 225 top
R46  75k  [R0603]  132.84,163.12 45 top
R47  144k  [R0603]  167,106.05 90 top
R48  22k  [R0603]  120.71,167.61 45 top
R49  .066  [R0603]  10.48,100.97 180 top
R50  .066  [R0603]  32.86,101.28 180 top
R51  360k  [R0603]  148.27,76.52 270 top
R52  180k  [R0603]  155.57,76.52 90 top
R53  1K  [R0603]  69.85,8.89 90 top
R54  0.10  [R0603]  133.85,157.17 135 top
R55  1K  [R0603]  8.02,30.24 45 top
R56  1K  [R0603]  12.46,25.8 45 top
R57  1K  [R0603]  16.91,21.35 45 top
R58  1K  [R0603]  21.43,16.83 45 top
R59  1K  [R0603]  25.72,12.46 45 top
R60  1K  [R0603]  30.24,8.02 45 top
R61  .22  [R0603]  173.67,93.66 180 top
R62  47k  [R0603]  153.03,138.43 180 top
R63  47k  [R0603]  140.02,72.39 0 top
R64  .183  [R0603]  160.02,64.14 180 top
R65  47k  [R0603]  140.02,69.53 0 top
R66  0.10  [R0603]  65.31,155.96 45 top
R67  0.10  [R0603]  92.39,157.16 45 top
R68  150k  [R0603]  15.72,128.91 270 top
R69  125k  [R0603]  26.35,127.64 270 top
R70  75k  [R0603]  27.94,127.64 90 top
R71  60k  [R0603]  16.19,122.24 90 top
R72  .132  [R0603]  10.48,123.83 180 top
R73  .132  [R0603]  32.86,124.14 180 top
R74  150k  [R0603]  24.76,182.18 225 top
R75  125k  [R0603]  30.94,174.21 225 top
R76  0.10  [R0603]  122.97,157.26 45 top
R77  120  [M1206]  133.03,19.05 90 top
R78  .263  [R0603]  47.31,185.1 270 top
R79  .183  [R0603]  145.41,67.63 180 top
R80  .22  [R0603]  166.05,97.47 0 top
R81  .31  [R0603]  133.03,34.92 270 top
R82  .11  [R0603]  11.75,148.27 180 top
R83  .174  [R0603]  166.05,67.63 270 top
R84  .786  [R0603]  31.75,16.83 270 top
R85  .11  [R0603]  127.64,192.72 270 top
R86  47k  [R0603]  55.24,107.63 270 top
R87  47k  [R0603]  58.42,117.79 0 top
R88  100k  [R0603]  195.58,31.75 180 top
R89  1K  [R0603]  34.29,8.89 90 top
R90  1K  [R0603]  8.26,33.66 0 top
R91  1k  [R0603]  173.67,38.42 90 top
R92  100k  [R0603]  181.61,173.67 0 top
R93  100k  [R0603]  181.61,171.61 0 top
R94  100k  [R0603]  181.61,163.83 180 top
R95  100k  [R0603]  196.85,161.61 180 top
R96  100k  [R0603]  186.06,185.42 0 top
R97  75k  [R0603]  32.51,172.64 45 top
R98  .033  [R0603]  32.86,55.56 180 top
R99  47k  [R0603]  108.27,35.56 0 top
R100  47k  [R0603]  128.27,22.86 180 top
R101  47k  [R0603]  109.38,30.48 0 top
R102  47k  [R0603]  107.63,32.07 180 top
R103  360k  [R0603]  161.93,106.05 270 top
R104  75k  [R0603]  169.23,106.05 90 top
R105  144k  [R0603]  129.54,46.2 90 top
R106  .31  [R0603]  124.78,31.75 0 top
R107  360k  [R0603]  124.46,46.2 270 top
R108  75k  [R0603]  131.76,46.2 90 top
R109  144k  [R0603]  23.5,154.31 90 top
R110  .11  [R0603]  30.16,141.92 180 top
R111  60k  [R0603]  20.38,177.13 45 top
R112  .066  [R0603]  17.47,182.3 135 top
R113  .066  [R0603]  33.52,166.69 135 top
R114  360k  [R0603]  18.41,154.31 270 top
R115  75k  [R0603]  25.72,154.31 90 top
R116  144k  [R0603]  173.35,76.52 90 top
R117  .174  [R0603]  180.02,64.14 180 top
R118  360k  [R0603]  168.28,76.52 270 top
R119  75k  [R0603]  175.58,76.52 90 top
R120  144k  [R0603]  37.47,24.92 90 top
R121  .786  [R0603]  27.94,19.53 90 top
R122  360k  [R0603]  32.38,24.92 270 top
R123  75k  [R0603]  39.69,24.92 90 top
R124  47k  [R0603]  112.08,20.64 90 top
R125  47k  [R0603]  124.78,36.83 0 top
R126  100k  [R0603]  181.61,165.74 180 top
R127  47k  [R0603]  71.12,21.91 90 top
R128  47k  [R0603]  68.9,22.86 90 top
R129  22  [R0603]  131.13,19.05 270 top
RESET_SW  B3SN-3012P  [SWITCH(B3SN)]  146.37,136.53 180 top
S1  CT2194MST  [SMS-004]  161.29,176.21 180 top
SW1  B3SN-3012P  [SWITCH(B3SN)]  48.26,3.81 0 top
SW2  B3SN-3012P  [SWITCH(B3SN)]  60.96,3.81 0 top
SW3  B3SN-3012P  [SWITCH(B3SN)]  73.66,3.81 0 top
U1  STM32F205VG  [PZ100]  111.76,101.6 45 top
U2  MCP601R  [SOT23-5]  55.56,190.82 90 top
U3  TPS62240DDC  [SOT23-5']  148.59,72.71 0 top
U4  MAX4376  [SOT23-5']  60.01,185.1 180 top
U5  TPS62240DDC  [SOT23-5']  48.58,190.5 0 top
U6  MCP601R  [SOT23-5]  130.49,185.74 0 top
U7  MAX4376  [SOT23-5']  124.78,181.29 90 top
U8  TPS62240DDC  [SOT23-5']  132.08,192.72 270 top
U9  MCP601R  [SOT23-5]  169.23,102.55 90 top
U10  MAX4376  [SOT23-5']  173.67,96.84 180 top
U11  MCP601R  [SOT23-5]  63.87,161.1 45 top
U12  Molex 500873-0816  [MICROSD]  120.65,8.89 180 top
U13  MAX4376  [SOT23-5']  160.02,67.31 180 top
U14  MAX4376  [SOT23-5']  77.67,159.41 135 top
U15  LM2623  [MSOP8]  69.93,167.16 45 top
U16  MCP601R  [SOT23-5]  93.08,161.1 45 top
U17  MCP601R  [SOT23-5]  21.91,73.03 90 top
U18  MAX4376  [SOT23-5']  10.48,74.93 0 top
U19  MAX4376  [SOT23-5']  10.48,52.07 0 top
U20  MAX4376  [SOT23-5']  32.86,81.6 180 top
U21  TPS62240DDC  [SOT23-5']  162.24,102.23 0 top
U22  LM2623  [MSOP8]  21.91,81.6 90 top
U23  MCP601R  [SOT23-5]  21.91,95.89 90 top
U24  MAX4376  [SOT23-5']  10.48,97.79 0 top
U25  MCP601R  [SOT23-5]  131.76,42.7 90 top
U26  MAX4376  [SOT23-5']  136.21,36.99 180 top
U27  MAX4376  [SOT23-5']  32.86,104.46 180 top
U28  LM2623  [MSOP8]  21.91,104.46 90 top
U29  MCP601R  [SOT23-5]  21.91,118.75 90 top
U30  MAX4376  [SOT23-5']  10.48,120.65 0 top
U31  MAX4376  [SOT23-5']  32.86,127.32 180 top
U32  LM2623  [MSOP8]  21.91,127.32 90 top
U33  MCP601R  [SOT23-5]  21.96,170.62 45 top
U34  MAX4376  [SOT23-5']  15.22,180.05 315 top
U35  MAX4376  [SOT23-5']  32.86,58.74 180 top
U36  MAX4376  [SOT23-5']  67.4,153.76 45 top
U37  MAX4376  [SOT23-5']  106.88,159.41 135 top
U38  LM2623  [MSOP8]  99.14,167.16 45 top
U39  MCP601R  [SOT23-5]  122.29,161.1 45 top
U40  LM2623  [MSOP8]  21.91,58.74 90 top
U41  MAX4376  [SOT23-5']  35.76,168.94 135 top
U42  LM2623  [MSOP8]  28.02,176.68 45 top
U43  TPS62240DDC  [SOT23-5']  124.78,42.39 0 top
U44  MCP601R  [SOT23-5]  25.72,150.81 90 top
U45  MCP601R  [SOT23-5]  21.91,50.16 90 top
U46  MAX4376  [SOT23-5']  30.16,145.1 180 top
U47  TPS62240DDC  [SOT23-5']  18.73,150.5 0 top
U48  MCP601R  [SOT23-5]  175.58,73.03 90 top
U49  MAX4376  [SOT23-5']  180.02,67.31 180 top
U50  MCP601R  [SOT23-5]  155.57,73.03 90 top
U51  TPS62240DDC  [SOT23-5']  168.59,72.71 0 top
U52  MCP601R  [SOT23-5]  39.69,21.43 90 top
U53  MAX4376  [SOT23-5']  44.13,15.72 180 top
U54  TPS62240DDC  [SOT23-5']  32.7,21.11 0 top
U55  MAX4376  [SOT23-5']  94.43,155.26 45 top
U56  MAX4376  [SOT23-5']  136.09,159.41 135 top
U57  LM2623  [MSOP8]  128.35,167.16 45 top
U58  HIH6130  [SO-08M]  118.43,34.92 270 top
U59  25MPX  [SO-08M]  118.43,22.23 270 top
U60  25AA512  [SO-08M]  118.43,28.57 270 top
U61  IS61WV51216-10ZSXI  [TSOPII-Z44]  146.37,101.6 0 top
U62  74HC4067  [SO24W]  60.64,62.87 90 top
U63  74HC4067  [SO24W]  60.64,97.16 90 top
U64  74HC4067  [SO24W]  60.64,80.01 90 top
U65  MAX6520  [SOT23]  102.55,12.06 180 top
U66  74HC259  [SO16]  60.64,111.76 90 top
U67  MCP601R  [SOT23-5]  95.57,12.38 180 top
U68  ADM3491ARZ  [SO14]  168.62,18.12 225 top
U69  MAX3232E  [SO16L]  177.8,118.75 90 top
U70  MAX4376  [SOT23-5']  125.06,155.16 45 top
U71  USB6B1  [SO08]  140.34,14.61 0 top
U72  74HC259  [SO16]  60.64,19.05 270 top
U73  74HC4067  [SO24W]  60.64,45.72 90 top
U74  MAX4376  [SOT23-5']  44.45,185.1 270 top
U75  MAX4376  [SOT23-5']  166.05,94.61 0 top
U76  MAX4376  [SOT23-5']  130.18,34.92 270 top
U77  MAX4376  [SOT23-5']  11.75,146.05 270 top
U78  MAX4376  [SOT23-5']  168.59,66.99 0 top
U79  MAX4376  [SOT23-5']  38.73,28.89 180 top
U80  MAX4376  [SOT23-5']  124.46,192.72 270 top
U81  RN42XV  [RN42XV]  189.23,166.37 0 top
U82  MAX4376  [SOT23-5']  148.59,66.36 0 top
U$1  [4,1]  151.76,22.86 0 top
U$2  [4,1]  161.61,154.31 0 top
U$3  [4,1]  55.88,154.31 0 top
U$4  [4,1]  21.59,31.75 0 top
U$25  XBEE802.15.4  [XBEE]  189.23,35.56 180 top
Y1  [HC49UP]  100.33,90.7 135 top

## Tracks (layer width: path | path; a pad name or v marks a point on that pad's centre or on a via)
485_DE  (via drill 0.38)
  Top 0.254: U1.66 125.83,117.79 v127.95,117.79
  Top 0.406: v123.51,66.67 123.51,57.15 127.95,52.7 140.65,52.7 144.78,48.58 144.78,41.95 U68.4 | v125.41,91.12 v125.41,66.67
  Bottom 0.254: v127.95,117.79 127.95,107.63 125.41,105.09
  Bottom 0.406: 125.41,105.09 v125.41,91.12 | v125.41,66.67 v123.51,66.67
!LED4  (via drill 0.38)
  Top 0.406: U72.4 54.61,19.68 v53.34,18.41 | v6.99,25.4 3.24,25.4 LED4.C
  Bottom 0.406: v6.99,25.4 16.19,16.19 51.12,16.19 v53.34,18.41
!LED5  (via drill 0.38)
  Top 0.406: U72.5 v55.88,18.41 | v8.89,19.68 7.65,20.92 LED5.C
  Bottom 0.406: v55.88,18.41 51.75,14.29 15.24,14.29 9.84,19.68 v8.89,19.68
!LED6  (via drill 0.38)
  Top 0.406: U72.6 v55.88,17.14 | v15.24,13.34 12.1,16.48 LED6.C
  Bottom 0.406: v55.88,17.14 51.75,13.02 15.56,13.02 v15.24,13.34
!LED7  (via drill 0.38)
  Top 0.406: U72.7 v55.88,15.88 | v19.05,12.06 16.57,12.06 LED7.C
  Bottom 0.406: v55.88,15.88 52.07,12.06 v19.05,12.06
!LED8  (via drill 0.38)
  Top 0.406: U72.9 v65.41,14.61 | v22.54,6.03 20.99,7.59 LED8.C
  Bottom 0.406: v65.41,14.61 61.91,11.11 27.62,11.11 v22.54,6.03
!LED9  (via drill 0.38)
  Top 0.406: U72.10 v66.67,15.88 | v26.67,1.91 25.43,3.14 LED9.C
  Bottom 0.406: v66.67,15.88 66.67,14.61 62.23,10.16 37.78,10.16 29.53,1.91 v26.67,1.91
!LED10  (via drill 0.38)
  Top 0.406: U72.11 v67.63,17.14 | v36.2,2.22 36.03,2.06 LED3.C
  Bottom 0.406: v67.63,17.14 67.63,13.97 63.18,9.53 44.45,9.53 37.15,2.22 v36.2,2.22
!LED11  (via drill 0.38)
  Top 0.406: U72.12 v66.67,18.41 | LED10.C 1.91,33.5 1.91,28.89 v3.49,27.3
  Bottom 0.406: v66.67,18.41 65.41,19.68 55.88,19.68 51.44,15.24 15.56,15.24 v3.49,27.3
!SW1  (via drill 0.38)
  Top 0.254: U1.7 102.44,96.52 97.16,96.52
  Top 0.406: R13.1 44.45,5.71 45.12,5.71 SW1.4 SW1.3 51.44,5.79 v51.44,8.57 | 97.16,96.52 95.25,98.42 v84.45,98.42 | v84.45,85.72 v84.45,39.69
  Bottom 0.406: v51.44,8.57 66.67,8.57 71.12,13.02 84.45,26.35 v84.45,39.69 | v84.45,98.42 v84.45,85.72
!SW2  (via drill 0.38)
  Top 0.254: U1.8 102.19,95.57 v97.79,95.57
  Top 0.406: R29.1 57.15,5.71 57.81,5.71 SW2.4 SW2.3 63.82,5.81 v63.82,6.99 | v93.98,21.27 93.98,55.56 96.84,58.42 96.84,64.77 97.79,65.72 v97.79,86.36
  Bottom 0.406: v63.82,6.99 66.67,6.99 70.8,11.11 73.03,11.11 83.19,21.27 v93.98,21.27 | v97.79,86.36 v97.79,95.57
!SW3  (via drill 0.38)
  Top 0.254: U1.9 103.19,95.86 v103.19,95.25
  Top 0.406: SW3.3 SW3.4 70.52,5.71 69.85,5.71 | R53.1 69.85,5.71 | 69.85,5.71 76.83,5.71 77.15,6.03 v77.15,8.57 | v95.57,20.32 v95.57,37.78 | v107.31,37.78 107.31,56.83 100.97,63.18 100.97,82.87 v103.19,85.09
  Bottom 0.254: v103.19,95.25 v103.19,85.09
  Bottom 0.406: v95.57,37.78 v107.31,37.78 | v95.57,20.32 88.9,20.32 v77.15,8.57
/RESET_MCU  (via drill 0.38)
  Top 0.254: U1.14 104.78,93.91 104.78,92.39 105.41,91.76 105.41,88.27 107.31,86.36 107.31,84.14
  Top 0.406: RESET_SW.2 RESET_SW.1 149.5,138.43 R62.2 | v97.79,136.53 99.38,138.11 109.54,138.11 111.44,140.02 140.34,140.02 141.92,138.43 143.27,138.43 RESET_SW.2 | 142.77,138.11 143.15,138.5 RESET_SW.2 | v97.79,114.94 97.79,115.69 J41.10 | 107.31,84.14 102.23,79.06 v102.23,69.22 | v95.89,85.72 v95.89,69.22
  Bottom 0.406: v97.79,136.53 v97.79,114.94 97.79,104.78 95.89,102.87 v95.89,85.72 | v95.89,69.22 v102.23,69.22
A16  (via drill 0.38)
  Top 0.254: v138.75,111.44 125.14,111.44 U1.58 | v138.75,106.05 138.75,107.21 U61.43
  Bottom 0.254: v138.75,111.44 v138.75,106.05
A17  (via drill 0.38)
  Top 0.254: v137.79,112.24 125.22,112.24 U1.59
  Top 0.406: U61.44 137.97,108.25 v137.79,108.43
  Bottom 0.406: v137.79,108.43 v137.79,112.24
A18  (via drill 0.38)
  Top 0.254: v150.81,113.03 125.31,113.03 U1.60 | U61.28 150.77,109.02 v150.81,109.06
  Bottom 0.254: v150.81,113.03 v150.81,109.06
ADC123_IN1  (via drill 0.38)
  Top 0.254: U1.24 109.22,91.28 109.22,88.27 111.12,86.36 111.12,82.23
  Top 0.406: v110.17,38.73 110.17,62.23 107.95,64.45 107.95,79.06 111.12,82.23 | U73.1 v87.31,38.73
  Bottom 0.406: v110.17,38.73 v87.31,38.73
ADC123_IN2  (via drill 0.38)
  Top 0.254: U1.25 109.86,91.21 109.86,88.27 111.76,86.36 111.76,81.92
  Top 0.406: v108.9,73.03 108.9,79.06 111.76,81.92 | U64.1 v75.25,73.03
  Bottom 0.406: v75.25,73.03 v108.9,73.03
ADC123_IN3  (via drill 0.38)
  Top 0.254: U1.26 113.67,91.21 v113.67,84.14
  Top 0.406: v74.93,86.68 71.44,90.17 65.72,90.17 U63.1
  Bottom 0.406: v74.93,86.68 74.93,84.77 75.56,84.14 v113.67,84.14
B0IN
  Top 0.406: U19.5 | U19.5 9.53,52.7 10.16,52.07 13.51,52.07 D3.A | U19.5 9.53,55.14 R22.2
B0INRAW
  Top 0.406: U19.4 11.43,55.15 R22.1 11.33,55.98 10.79,56.52 J13.2 6.35,51.44 19.05,38.73 52.7,38.73 53.98,40.01 U73.23
B0LVEN  (via drill 0.38)
  Top 0.406: U45.4 19.37,51.12 18.73,51.75 D2.C | R20.1 18.69,52.81 D2.C | D2.C 18.73,53.66 17.78,54.61 v17.78,55.56 | U17.4 19.37,73.97 18.73,74.61 D53.C | R23.1 18.69,75.67 D53.C | D53.C 18.73,76.52 17.78,77.47 v17.78,78.42 | U23.4 19.37,96.83 18.73,97.47 D58.C | R42.1 18.69,98.53 D58.C | D58.C 18.73,99.38 17.78,100.33 v17.78,101.28 | U33.4 20.83,173.09 20.83,173.99 D68.C | 21.55,174.77 D68.C | D68.C 22.18,175.34 22.18,176.68 v22.85,177.36 | U29.4 19.37,119.69 18.73,120.33 D63.C | R71.1 18.69,121.39 D63.C | D63.C 18.73,122.24 17.78,123.19 v17.78,124.14 | U11.4 62.74,163.56 62.74,164.47 D13.C | D13.C 63.46,165.24 R11.1 | D13.C 64.09,165.81 64.09,167 v64.76,167.67 | U16.4 91.95,163.56 91.95,164.47 D16.C | 92.67,165.24 D16.C | D16.C 93.3,165.81 93.3,167.16 v93.97,167.83 | U39.4 121.16,163.56 121.16,164.47 D19.C 121.88,165.24 R48.1 114.42,172.7 v102.02,172.7 | v73.18,176.05 82.23,167.01 R28.1 92.67,165.24 | 92.67,165.24 D16.C | R111.1 19.84,176.53 D68.C | R11.1 61.59,167.01 60.96,167.64 51.12,167.64 50.48,168.28 v50.48,180.97 | R11.1
  Bottom 0.406: v50.48,180.97 26.47,180.97 v22.85,177.36 17.78,172.28 v17.78,124.14 17.78,110.81 18.1,110.49 18.1,107.95 17.78,107.63 v17.78,101.28 17.78,87.63 18.1,87.31 18.1,85.09 17.78,84.77 v17.78,78.42 17.78,64.77 18.1,64.45 18.1,62.55 17.78,62.23 v17.78,55.56 | v93.97,167.83 98.84,172.7 v102.02,172.7 | v73.18,176.05 64.8,167.67 v64.76,167.67
B0OUT
  Top 0.406: U35.5 33.81,55.66 R98.1 33.71,53.4 J3.1
B0OUTRAW  (via drill 0.38)
  Top 0.406: U35.4 31.91,55.66 R98.2 D5.C 29.99,51.97 C67.1 v28.26,51.75 | D55.C 29.99,74.83 C12.1 v28.26,74.61
  Bottom 0.406: v28.26,74.61 28.89,73.98 28.89,52.39 v28.26,51.75
B1IN
  Top 0.406: U18.5 | U18.5 9.53,75.56 10.16,74.93 13.51,74.93 D51.A | U18.5 9.53,78 R24.2
B1INRAW  (via drill 0.38)
  Top 0.406: U18.4 11.43,78 R24.1 11.33,78.84 10.79,79.38 J5.2 4.13,77.15 4.13,52.39 v16.51,40.01 | U73.22 53.66,41.27 52.39,40.01 v19.05,40.01
  Bottom 0.406: v19.05,40.01 v16.51,40.01
B1OUT
  Top 0.406: U20.5 33.81,78.52 R25.1 33.71,76.26 J2.1
B1OUTRAW
  Top 0.406: U20.4 31.91,78.52 R25.2
B2IN
  Top 0.406: U24.5 | U24.5 9.53,98.42 10.16,97.79 13.51,97.79 D56.A | U24.5 9.53,100.86 R49.2
B2INRAW  (via drill 0.38)
  Top 0.406: U24.4 11.43,100.86 R49.1 11.33,101.7 10.79,102.23 J18.2 3.33,99.22 3.33,51.91 v13.97,41.27 | U73.21 53.34,42.55 52.07,41.27 v17.78,41.27
  Bottom 0.406: v17.78,41.27 v13.97,41.27
B2OUT
  Top 0.406: U27.5 33.81,101.38 R50.1 33.71,99.12 J4.1
B2OUTRAW
  Top 0.406: C68.1 29.99,97.69 D60.C R50.2 31.91,101.38 U27.4
B3IN
  Top 0.406: U30.5 | U30.5 9.53,121.28 10.16,120.65 13.51,120.65 D61.A | U30.5 9.53,123.72 R72.2
B3INRAW  (via drill 0.38)
  Top 0.406: U30.4 11.43,123.72 R72.1 11.33,124.56 10.79,125.09 J19.2 2.54,121.28 2.54,51.44 v11.43,42.55 | U73.20 53.02,43.81 51.75,42.55 v16.51,42.55
  Bottom 0.406: v16.51,42.55 v11.43,42.55
B3OUT
  Top 0.406: U31.5 33.81,124.24 R73.1 33.71,121.98 J6.1
B3OUTRAW
  Top 0.406: C111.1 29.99,120.55 D65.C R73.2 31.91,124.24 U31.4
B4IN
  Top 0.406: 15,181.17 15,179.95 17.14,177.8 18.41,177.8 22.06,181.44 | 15,181.17 16.72,182.9 R112.2 | 24.04,181.58 L12.1 22.9,180.6 22.06,181.44 | 22.06,181.44 C115.2 | R74.2 24.04,181.58 | 24.04,181.58 | 15,181.17 U34.5
B4INRAW  (via drill 0.38)
  Top 0.406: R112.1 18.59,182.22 18.59,183.45 J17.5 J17.6 J17.7 J17.8 1.75,172.56 1.75,50.96 v8.89,43.81 | R8.2 17.82,179.29 U34.4 18.07,181.55 R112.1 | U73.19 52.7,45.09 51.44,43.81 v15.24,43.81 | R112.1
  Bottom 0.406: v15.24,43.81 v8.89,43.81
B4OUT
  Top 0.406: J7.1 35.85,167.35 U41.5 34.26,166.09 R113.1
B4OUTRAW
  Top 0.406: C149.1 28.95,166.18 D70.C 32.77,167.44 32.92,167.44 | U41.4 32.92,167.44 | 32.92,167.44 | 32.92,167.44 R113.2
B5INRAW  (via drill 0.38)
  Top 0.406: 65.94,172.06 L2.1 64.81,171.07 C13.2 63.19,172.72 v62.23,173.67 | U36.5 64.71,155.11 R66.1 64.29,154.94 63.18,154.94 58.42,159.7 v58.42,164.15 | 65.94,172.06 | 65.94,172.06 R6.2
  Bottom 0.406: v58.42,164.15 58.42,169.86 v62.23,173.67
B5OUT  (via drill 0.38)
  Top 0.406: U14.5 76.17,156.57 | D30.A v85.09,185.74 | 76.03,156.53 R14.1 | 76.17,156.57 | 76.17,156.57 R14.1 | U73.18 v51.44,46.35 | v51.44,34.61 88.27,34.61 89.22,35.56 v89.22,85.72 | v89.22,156.53 v79.69,156.53 76.07,156.53 R14.1
  Bottom 0.406: v89.22,156.53 v89.22,85.72 | v51.44,46.35 v51.44,34.61 | v85.09,185.74 79.69,180.34 v79.69,156.53
B5OUTRAW
  Top 0.406: C25.1 70.86,156.66 D15.C R14.2 | U14.4 74.83,157.91 R14.2 | R14.2
B6INRAW  (via drill 0.38)
  Top 0.406: 95.16,172.06 L3.1 94.02,171.07 | 94.02,171.07 94.02,171.09 | 94.02,171.07 C27.2 92.71,172.38 92.71,172.4 v85.41,172.4 | R67.1 92.84,155.51 U55.5 91.96,154.62 v85.41,154.62 | 95.16,172.06 | 95.16,172.06 R15.2
  Bottom 0.406: v85.41,172.4 v85.41,154.62
B6OUT  (via drill 0.38)
  Top 0.406: v88.27,35.72 v88.27,86.36 | D34.A v95.89,185.74 | 105.41,156.4 R30.1 | v88.27,151.13 104.14,151.13 105.24,152.23 R30.1 | U73.17 v48.58,47.62 | v48.58,31.75 v88.27,31.75 | v107.95,157.48 106.98,157.48 U37.5 105.38,156.57 R30.1
  Bottom 0.406: v107.95,157.48 107.95,173.67 v95.89,185.74 | v88.27,151.13 v88.27,86.36 | v88.27,31.75 v88.27,35.72 | v48.58,47.62 v48.58,31.75
B6OUTRAW
  Top 0.406: C49.1 100.07,156.66 D18.C 103.89,157.91 104.04,157.91 | U37.4 104.04,157.91 | R30.2 | R30.2 104.04,157.91
B7INRAW  (via drill 0.38)
  Top 0.406: L4.1 124.36,172.06 | L4.1 123.23,171.07 C51.2 | U70.5 122.36,156.51 R76.1 120.84,156.65 v120.65,156.84 | L4.1 123.23,171.09 v120.65,173.67 | R44.2 124.36,172.06 | 124.36,172.06
  Bottom 0.406: v120.65,173.67 v120.65,156.84
B7OUT  (via drill 0.38)
  Top 0.406: 134.59,156.57 U56.5 134.55,156.53 134.3,156.53 v134.3,155.26 | v134.3,136.21 113.03,136.21 111.12,134.3 100.65,134.3 v91.12,124.78 | v116.2,185.74 109.39,185.74 D35.A | 134.59,156.57 134.34,156.57 | 134.59,156.57 | 134.59,156.57 R54.1 | v50.48,32.7 88.27,32.7 91.12,35.56 91.12,42.55 93.03,44.45 v93.03,86.36 | v50.48,48.9 U73.16
  Bottom 0.406: v91.12,124.78 91.12,110.81 93.03,108.9 v93.03,86.36 | v50.48,32.7 v50.48,48.9 | v134.3,136.21 v134.3,155.26 134.3,172.09 129.86,176.53 118.43,176.53 117.16,177.8 117.16,184.78 v116.2,185.74
B7OUTRAW
  Top 0.406: C56.1 129.28,156.66 D21.C R54.2 133.25,157.91 | U56.4 133.25,157.91 | 133.25,157.91
BOOST4EN  (via drill 0.38)
  Top 0.254: U1.32 117.47,91.64 117.47,82.55
  Top 0.406: U32.2 v25.07,126.99 v25.08,127 | v25.08,131.13 30.48,131.13 31.75,129.86 91.12,129.86 v93.98,132.72 | 117.47,82.55 v116.2,81.28 | v93.98,85.72 v93.98,81.28
  Bottom 0.406: v25.08,127 v25.08,131.13 | v93.98,85.72 v93.98,132.72 | v93.98,81.28 v116.2,81.28
BOOST5EN  (via drill 0.38)
  Top 0.254: U1.67 126.08,118.75 v127.95,118.75
  Top 0.406: U15.2 71.75,164.87 71.75,164.47 v71.12,163.83 | v127.95,150.18 v71.12,150.18
  Bottom 0.406: v71.12,163.83 v71.12,150.18 | v127.95,118.75 v127.95,150.18
BOOST6EN  (via drill 0.38)
  Top 0.406: U38.2 99.47,166.37 v99.38,166.37 | v98.42,146.37 v92.08,146.37 | v92.08,111.12 U66.4
  Bottom 0.406: v99.38,166.37 98.42,165.42 v98.42,146.37 | v92.08,146.37 v92.08,111.12
BOOST7EN  (via drill 0.38)
  Top 0.406: v132.72,144.46 v68.58,144.46 | v130.33,164.62 129.57,165.39 U57.2 | v68.58,112.39 U66.5
  Bottom 0.406: v130.33,164.62 132.72,162.24 v132.72,144.46 | v68.58,112.39 v68.58,144.46
BOOSTADJ0
  Top 0.406: U45.3 23.49,51.12 23.5,51.12 | 23.5,51.12 23.5,52.81 23.44,52.86 C32.1 | 23.5,51.12 24.13,51.12 24.77,50.48 24.77,49.85 26.67,47.94 39.37,47.94 48.58,57.15 U62.23
BOOSTADJ1  (via drill 0.38)
  Top 0.406: v43.5,70.96 25.88,70.96 24.61,72.23 24.61,73.34 23.97,73.97 U17.3 23.49,73.97 23.5,73.98 23.5,75.67 23.44,75.72 C9.1 | U62.22 v43.5,58.42
  Bottom 0.406: v43.5,58.42 v43.5,70.96
BOOSTADJ2  (via drill 0.38)
  Top 0.406: U23.3 23.49,96.83 | 23.49,96.83 23.5,96.84 23.5,98.53 23.44,98.58 C30.1 | v44.77,90.01 26.19,90.01 24.45,91.76 24.45,96.52 24.13,96.83 23.49,96.83 | U62.21 v44.77,59.69
  Bottom 0.406: v44.77,90.01 v44.77,59.69
BOOSTADJ3  (via drill 0.38)
  Top 0.406: v48.58,108.11 34.77,108.11 24.45,118.43 24.45,119.06 23.82,119.69 U29.3 23.21,121.42 C72.1 | U62.20 v48.58,60.96
  Bottom 0.406: v48.58,60.96 v48.58,108.11
BOOSTADJ4  (via drill 0.38)
  Top 0.406: U33.3 23.75,170.17 24.95,171.37 24.95,171.45 C129.1 25.34,171.05 v25.98,171.05 | U62.19 v47.62,62.23
  Bottom 0.406: v25.98,171.05 38.5,171.05 46.67,162.88 46.67,130.18 47.62,129.22 v47.62,62.23
BOOSTADJ5  (via drill 0.38)
  Top 0.406: U11.3 65.66,160.65 66.86,161.84 66.71,161.99 C22.1 v67.57,161.21 | U62.18 v50.48,63.5
  Bottom 0.406: v50.48,63.5 50.48,160.66 51.04,161.21 v67.57,161.21
BOOSTADJ6  (via drill 0.38)
  Top 0.406: U16.3 94.87,160.65 96.07,161.84 95.92,161.99 C42.1 96.06,162.07 v96.84,161.29 | v96.84,138.11 90.49,131.76 v38.1,131.76 | v38.1,64.77 U62.17
  Bottom 0.406: v38.1,64.77 v38.1,131.76 | v96.84,161.29 v96.84,138.11
BOOSTADJ7  (via drill 0.38)
  Top 0.406: 124.08,160.65 U39.3 123.94,160.91 124.08,160.91 124.08,161.01 C53.1 125.73,161.47 v125.73,160.97 | v125.73,137.16 112.39,137.16 110.49,135.25 100.33,135.25 89.22,124.14 v37.15,124.14 | U62.16 v37.15,66.04
  Bottom 0.406: v125.73,160.97 v125.73,137.16 | v37.15,66.04 v37.15,124.14
BOOSTINCUR0  (via drill 0.38)
  Top 0.406: v51.44,55.88 48.58,55.88 40.01,47.31 26.67,47.31 26.35,46.99 12.06,46.99 9.53,49.53 U19.1 | U64.23 v51.44,74.3
  Bottom 0.406: v51.44,55.88 v51.44,74.3
BOOSTINCUR1
  Top 0.406: U64.22 50.48,75.56 44.93,70.01 11.91,70.01 9.53,72.39 U18.1
BOOSTINCUR2  (via drill 0.38)
  Top 0.406: v41.91,89.22 11.75,89.22 9.53,91.44 U24.1 | U64.21 v41.91,76.83
  Bottom 0.406: v41.91,76.83 v41.91,89.22
BOOSTINCUR3  (via drill 0.38)
  Top 0.406: v45.72,106.68 34.61,106.68 33.34,107.95 24.45,107.95 19.68,112.71 14.92,112.71 9.53,118.11 U30.1 | U64.20 v45.72,78.11
  Bottom 0.406: v45.72,78.11 v45.72,106.68
BOOSTINCUR4  (via drill 0.38)
  Top 0.406: U64.19 v51.44,79.38 | v51.44,144.46 44.13,144.46 12.75,175.84 12.75,178.93 U34.1
  Bottom 0.406: v51.44,79.38 v51.44,144.46
BOOSTINCUR5  (via drill 0.38)
  Top 0.406: v43.81,135.89 v67.63,135.89 | U64.18 v43.81,80.64 | v67.63,150.81 67.63,152.15 U36.1
  Bottom 0.406: v43.81,80.64 v43.81,135.89 | v67.63,150.81 v67.63,135.89
BOOSTINCUR6  (via drill 0.38)
  Top 0.406: v42.86,136.84 92.08,136.84 v93.66,138.43 | U64.17 v42.86,81.92 | v93.66,152.72 94.61,153.67 U55.1
  Bottom 0.406: v42.86,81.92 v42.86,136.84 | v93.66,152.72 v93.66,138.43
BOOSTINCUR7  (via drill 0.38)
  Top 0.406: v40.96,133.67 90.17,133.67 98.42,141.92 v123.83,141.92 | U64.16 v40.96,83.19 | v123.83,153.67 125.21,153.67 U70.1
  Bottom 0.406: v40.96,83.19 v40.96,133.67 | v123.83,141.92 v123.83,153.67
BOOSTOUTCUR0  (via drill 0.38)
  Top 0.406: v46.67,61.59 34.29,61.59 33.81,61.12 U35.1 | U63.23 v46.67,91.44
  Bottom 0.406: v46.67,61.59 v46.67,91.44
BOOSTOUTCUR1  (via drill 0.38)
  Top 0.406: v39.05,83.19 34.1,83.19 U20.1 | v39.05,92.71 U63.22
  Bottom 0.406: v39.05,92.71 v39.05,83.19
BOOSTOUTCUR2
  Top 0.406: U63.21 43.18,93.98 37.15,100.01 37.15,103.19 34.61,105.73 33.84,105.73 U27.1
BOOSTOUTCUR3  (via drill 0.38)
  Top 0.406: v46.67,128.91 33.84,128.91 33.84,128.65 U31.1 | v46.67,95.25 U63.20
  Bottom 0.406: v46.67,95.25 v46.67,128.91
BOOSTOUTCUR4  (via drill 0.38)
  Top 0.406: v39.05,169.23 37.4,169.23 U41.1 | v44.77,96.52 U63.19
  Bottom 0.406: v39.05,169.23 45.72,162.56 45.72,134.3 44.77,133.35 v44.77,96.52
BOOSTOUTCUR5  (via drill 0.38)
  Top 0.406: v41.91,134.94 v81.6,134.94 | v41.91,97.79 U63.18 | U14.1 79.26,159.75 80.49,160.97 v81.6,160.97
  Bottom 0.406: v41.91,97.79 v41.91,134.94 | v81.6,160.97 v81.6,134.94
BOOSTOUTCUR6  (via drill 0.38)
  Top 0.406: v40.01,130.81 90.81,130.81 99.06,139.06 109.22,139.06 v109.86,139.7 | v40.01,99.06 U63.17 | U37.1 108.63,159.66 v109.86,158.43
  Bottom 0.406: v40.01,99.06 v40.01,130.81 | v109.86,139.7 109.86,152.4 v109.86,158.43
BOOSTOUTCUR7  (via drill 0.38)
  Top 0.406: v39.05,127.95 90.49,127.95 99.69,137.16 109.86,137.16 111.76,139.06 139.7,139.06 141.6,137.16 v150.18,137.16 | v150.18,159.38 138.75,159.38 | 138.75,159.38 138.59,159.38 | v39.05,100.33 U63.16 | U56.1 137.96,159.38 138.75,159.38
  Bottom 0.406: v39.05,100.33 v39.05,127.95 | v150.18,137.16 v150.18,159.38
BT_CTSRTS
  Bottom 0.406: U81.16 199.07,167.64 198.44,167 198.44,160.34 199.13,159.64 U81.12
BT_FRST
  Top 0.406: PAD5.1 178.2,161.61 U81.8
BT_RST  (via drill 0.38)
  Top 0.254: U1.36 121.28,90.66 121.28,86.36
  Top 0.406: U81.5 174.31,167.64 171.13,164.47 171.13,127.32 v160.02,127.32 | 121.28,86.36 120.33,85.41 v120.33,73.03
  Bottom 0.406: v120.33,73.03 130.18,73.03 130.49,73.34 131.76,73.34 132.08,73.03 136.84,73.03 137.16,73.34 140.34,73.34 160.02,93.03 160.02,117.79 159.7,118.11 159.7,118.75 160.02,119.06 v160.02,127.32
BUCKADJ0  (via drill 0.38)
  Top 0.406: U50.3 157.64,73.97 158.12,74.45 C58.1 158.69,74.87 159.38,75.56 161.93,75.56 162.88,74.61 162.88,62.23 161.61,60.96 v135.89,60.96 | v72.39,66.04 U62.9
  Bottom 0.406: v72.39,66.04 72.39,61.59 73.03,60.96 v135.89,60.96
BUCKADJ1  (via drill 0.38)
  Top 0.406: C130.1 58.1,192.25 57.62,191.77 U2.3 56.87,192.69 v56.83,192.72 | v48.58,183.2 v48.58,165.42 | v71.44,64.77 U62.8 | v72.39,141.6 v48.58,141.6
  Bottom 0.406: v56.83,192.72 56.83,189.55 50.48,183.2 v48.58,183.2 | v71.44,64.77 71.44,89.85 72.39,90.81 72.39,114.94 v72.39,141.6 | v48.58,141.6 v48.58,165.42
BUCKADJ2  (via drill 0.38)
  Top 0.406: v137.79,59.05 v173.04,59.05 | 170.5,103.54 U9.3 171.29,103.5 171.77,103.98 C138.1 172.4,104.04 172.4,104.46 v173.04,105.09 | v71.44,63.5 U62.7
  Bottom 0.406: v71.44,63.5 71.44,61.28 73.66,59.05 v137.79,59.05 | v173.04,105.09 v173.04,59.05
BUCKADJ3  (via drill 0.38)
  Top 0.406: 133.03,43.65 U25.3 133.82,43.65 134.3,44.13 C144.1 134.94,44.19 v134.94,47.94 | U62.6 67.63,62.23 70.48,62.23 72.39,60.33 v72.39,50.48
  Bottom 0.406: v72.39,50.48 76.83,50.48 78.74,52.39 105.73,52.39 106.68,53.34 129.54,53.34 v134.94,47.94
BUCKADJ4  (via drill 0.38)
  Top 0.406: C153.1 28.26,152.24 27.78,151.76 U44.3 27.02,153.03 28.61,154.62 30.16,154.62 45.09,139.7 v71.44,139.7 | v70.48,60.96 U62.5
  Bottom 0.406: v70.48,60.96 70.48,90.17 71.44,91.12 71.44,114.62 v71.44,139.7
BUCKADJ5  (via drill 0.38)
  Top 0.406: U48.3 177.64,73.97 178.12,74.45 C159.1 178.75,74.51 v178.75,75.56 | v130.18,55.24 149.86,55.24 v153.03,52.07 | v156.84,52.07 160.97,56.2 v178.75,56.2 | v70.48,59.69 U62.4 | v81.28,54.29 v81.28,58.1
  Bottom 0.406: v70.48,59.69 72.07,58.1 v81.28,58.1 | v153.03,52.07 v156.84,52.07 | v178.75,56.2 v178.75,75.56 | v130.18,55.24 129.22,54.29 v81.28,54.29
BUCKADJ6  (via drill 0.38)
  Top 0.406: U52.3 41.75,22.38 42.23,22.86 C165.1 42.86,22.92 42.86,23.5 46.35,26.99 47.31,27.94 v70.48,27.94 | v70.48,58.42 U62.3
  Bottom 0.406: v70.48,27.94 v70.48,58.42
BUCKADJ7  (via drill 0.38)
  Top 0.406: U6.3 131.44,183.68 131.92,183.2 C20.1 132.98,182.62 v133.03,182.56 139.38,176.21 v144.78,176.21 | v93.98,57.15 v93.98,76.83 | v71.44,57.15 U62.2
  Bottom 0.406: v71.44,57.15 v93.98,57.15 | v93.98,76.83 140.34,76.83 158.43,94.93 158.43,137.79 154.62,141.6 154.62,166.37 v144.78,176.21
BUCKINCUR0  (via drill 0.38)
  Top 0.406: U64.9 v74.93,83.19 | v124.46,83.19 v124.46,68.58 | v142.88,68.58 142.88,67.63 145.41,65.09 147.61,65.09 U82.1
  Bottom 0.406: v74.93,83.19 v124.46,83.19 | v124.46,68.58 v142.88,68.58
BUCKINCUR1  (via drill 0.38)
  Top 0.254: U74.1
  Top 0.406: U64.8 v74.3,81.92 | v75.25,148.27 v47.62,148.27 | v44.45,166.69 44.45,185.42 43.81,186.06 U74.1
  Bottom 0.406: v74.3,81.92 74.3,82.55 73.98,82.87 73.98,89.22 75.25,90.49 v75.25,148.27 | v47.62,148.27 47.62,163.51 v44.45,166.69
BUCKINCUR2  (via drill 0.38)
  Top 0.406: U64.7 v74.3,80.64 | v145.1,87 v164.15,87 | v164.15,93.34 165.07,93.34 U75.1
  Bottom 0.406: v74.3,80.64 75.88,82.23 140.34,82.23 v145.1,87 | v164.15,87 v164.15,93.34
BUCKINCUR3  (via drill 0.38)
  Top 0.406: v116.84,41.59 116.84,79.38 v117.79,80.33 | U64.6 v74.3,79.38 | U76.1 v130.17,35.88 v130.18,35.88
  Bottom 0.406: v117.79,80.33 75.25,80.33 v74.3,79.38 | v130.18,35.88 127.64,35.88 121.92,41.59 v116.84,41.59
BUCKINCUR4  (via drill 0.38)